# Altium schematic sheet IRIS-FE-01-B-LEDs.SchDoc
size A
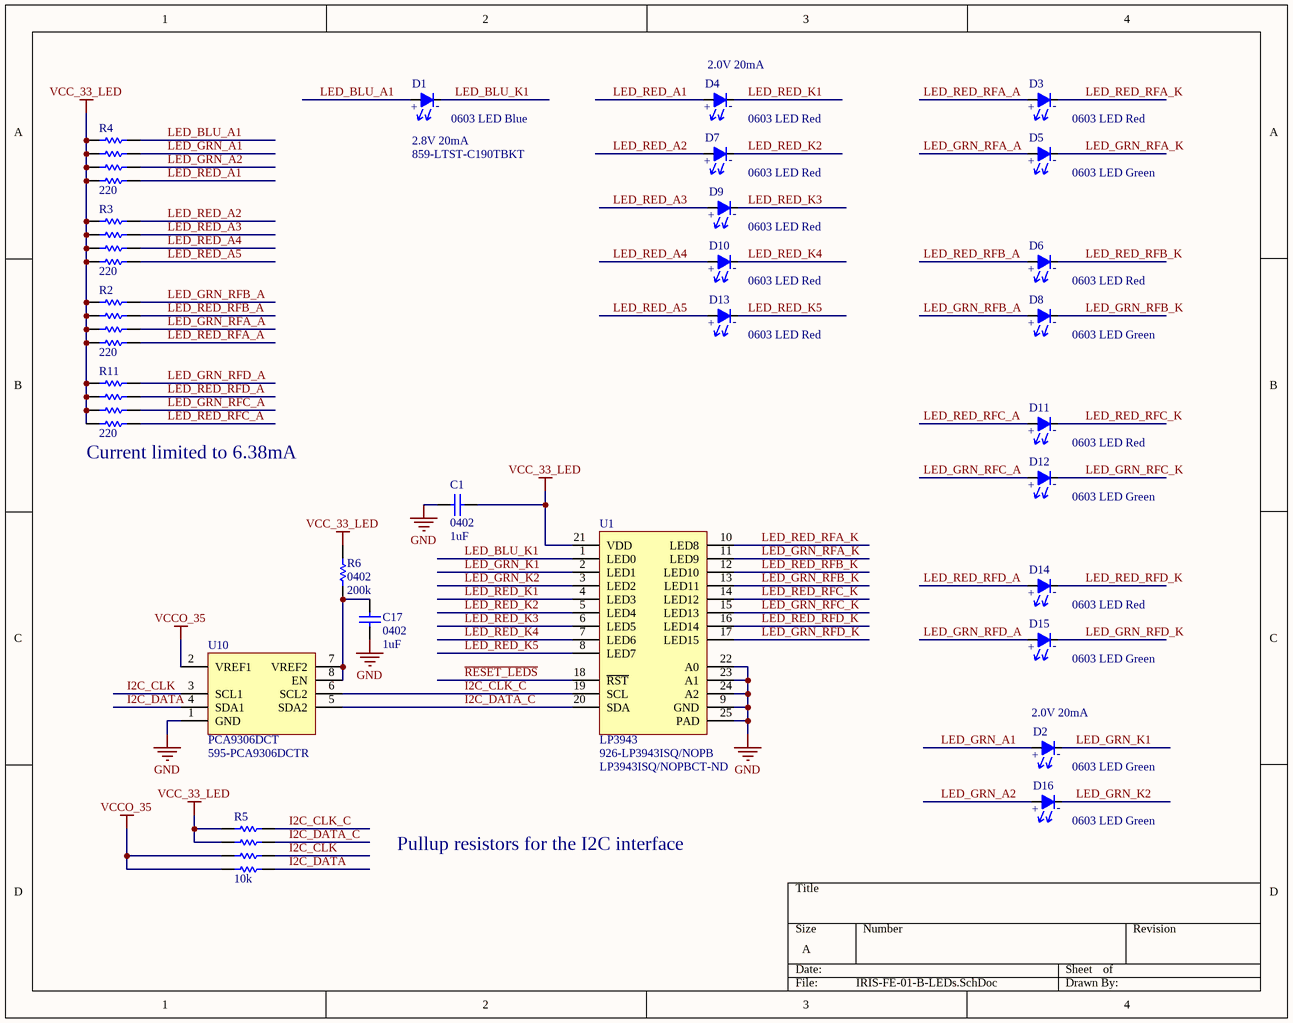
[diagram p0: IRIS-FE-01-B-LEDs.SchDoc]

## Parts
C1  0402  value 1uF  [0402_SMT_CAP]
C17  0402  value 1uF  [0402_SMT_CAP]
D1  0603 LED Blue  value 2.8V 20mA  Supplier Part Number 1: 859-LTST-C190TBKT  [0603_SMT_LED_Blue]
D2  0603 LED Green  value 2.0V 20mA  [0603_SMT_LED_Green]
D3  0603 LED Red  [0603_SMT_LED_Red]
D4  0603 LED Red  value 2.0V 20mA  [0603_SMT_LED_Red]
D5  0603 LED Green  [0603_SMT_LED_Green]
D6  0603 LED Red  [0603_SMT_LED_Red]
D7  0603 LED Red  [0603_SMT_LED_Red]
D8  0603 LED Green  [0603_SMT_LED_Green]
D9  0603 LED Red  [0603_SMT_LED_Red]
D10  0603 LED Red  [0603_SMT_LED_Red]
D11  0603 LED Red  [0603_SMT_LED_Red]
D12  0603 LED Green  [0603_SMT_LED_Green]
D13  0603 LED Red  [0603_SMT_LED_Red]
D14  0603 LED Red  [0603_SMT_LED_Red]
D15  0603 LED Green  [0603_SMT_LED_Green]
D16  0603 LED Green  [0603_SMT_LED_Green]
R2  value 220  [EXB28V]  (hidden comment: 0402 Array)
R3  value 220  [EXB28V]  (hidden comment: 0402 Array)
R4  value 220  [EXB28V]  (hidden comment: 0402 Array)
R5  value 10k  [EXB28V]  (hidden comment: 0402 Array)
R6  0402  value 200k  [0402_SMT_RES]
R11  value 220  [EXB28V]  (hidden comment: 0402 Array)
U1  LP3943  Supplier Part Number 1: 926-LP3943ISQ/NOPB  Supplier Part Number 2: LP3943ISQ/NOPBCT-ND  [TI-QFN127P600-8N]
U10  PCA9306DCT  Supplier Part Number 1: 595-PCA9306DCTR  [TI-SOP127P600-8N]

## Nets
GND: C1.2 C17.1 U1.9(GND) U1.22(A0) U1.23(A1) U1.24(A2) U1.25(PAD) U10.1(GND)
VCC_33_LED: C1.1 R2.1 R2.2 R2.3 R2.4 R3.1 R3.2 R3.3 R3.4 R4.1 R4.2 R4.3 R4.4 R5.5 R5.6 R6.2 R11.1 R11.2 R11.3 R11.4 U1.21(VDD)
VCCO_35: R5.7 R5.8 U10.2(VREF1)
~{RESET_LEDS}: U1.18(~{RST})
I2C_CLK: R5.2 U10.3(SCL1)
I2C_CLK_C: R5.4 U1.19(SCL) U10.6(SCL2)
I2C_DATA: R5.1 U10.4(SDA1)
I2C_DATA_C: R5.3 U1.20(SDA) U10.5(SDA2)
LED_BLU_A1: D1.1(P) R4.8
LED_BLU_K1: D1.2(N) U1.1(LED0)
LED_GRN_A1: D2.1(P) R4.7
LED_GRN_A2: D16.1(P) R4.6
LED_GRN_K1: D2.2(N) U1.2(LED1)
LED_GRN_K2: D16.2(N) U1.3(LED2)
LED_GRN_RFA_A: D5.1(P) R2.6
LED_GRN_RFA_K: D5.2(N) U1.11(LED9)
LED_GRN_RFB_A: D8.1(P) R2.8
LED_GRN_RFB_K: D8.2(N) U1.13(LED11)
LED_GRN_RFC_A: D12.1(P) R11.6
LED_GRN_RFC_K: D12.2(N) U1.15(LED13)
LED_GRN_RFD_A: D15.1(P) R11.8
LED_GRN_RFD_K: D15.2(N) U1.17(LED15)
LED_RED_A1: D4.1(P) R4.5
LED_RED_A2: D7.1(P) R3.8
LED_RED_A3: D9.1(P) R3.7
LED_RED_A4: D10.1(P) R3.6
LED_RED_A5: D13.1(P) R3.5
LED_RED_K1: D4.2(N) U1.4(LED3)
LED_RED_K2: D7.2(N) U1.5(LED4)
LED_RED_K3: D9.2(N) U1.6(LED5)
LED_RED_K4: D10.2(N) U1.7(LED6)
LED_RED_K5: D13.2(N) U1.8(LED7)
LED_RED_RFA_A: D3.1(P) R2.5
LED_RED_RFA_K: D3.2(N) U1.10(LED8)
LED_RED_RFB_A: D6.1(P) R2.7
LED_RED_RFB_K: D6.2(N) U1.12(LED10)
LED_RED_RFC_A: D11.1(P) R11.5
LED_RED_RFC_K: D11.2(N) U1.14(LED12)
LED_RED_RFD_A: D14.1(P) R11.7
LED_RED_RFD_K: D14.2(N) U1.16(LED14)
NetC17_2: C17.2 R6.1 U10.7(VREF2) U10.8(EN)

## Notes on the sheet
- (near R11) Current limited to 6.38mA
- Pullup resistors for the I2C interface
- (in symbol LED_0603_BLUE) +; -
- (in symbol LED_0603_GREEN) +; -
- (in symbol LED_0603_RED) +; -

## Library data of the parts
C1 C17 = Cap_0402: 0402 SMT Capacitor; Supplier 1: Mouser; Supplier Part Number 1: 81-GRM155R61E105KA2D
D1 = LED_0603_BLUE: 0603 LED with Polar Markings; Supplier 1: Mouser
D2 = LED_0603_GREEN: 0603 LED with Polar Markings; Supplier 1: Mouser; Supplier Part Number 1: 859-LTST-C191KGKT
D3 D6 D7 D9-D11 D13 D14 = LED_0603_RED: 0603 LED with Polar Markings; Value: 2.0V 20mA; Supplier 1: Mouser; Supplier Part Number 1: 859-LTST-C191KRKT
D4 = LED_0603_RED: 0603 LED with Polar Markings; Supplier 1: Mouser; Supplier Part Number 1: 859-LTST-C191KRKT
D5 D8 D12 D15 D16 = LED_0603_GREEN: 0603 LED with Polar Markings; Value: 2.0V 20mA; Supplier 1: Mouser; Supplier Part Number 1: 859-LTST-C191KGKT
R2-R5 R11 = Res_0402_4xArray: 0402 SMT Resistor Array; Supplier 1: Mouser
  R2-R4 R11: Supplier Part Number 1: 667-EXB-28V221JX
  R5: Supplier Part Number 1: 667-EXB-28V103JX; Supplier 2: Digi-Key; Supplier Part Number 2: Y7103CT-ND
R6 = Res_0402: 0402 SMT Resistor; Supplier 1: Mouser; Supplier Part Number 1: 667-ERJ-2RKF2003X
U1 = LP3943: TI 16-LED Fun Light Driver with I2C; Supplier 1: Mouser; Supplier 2: Digi-Key
U10 = PCA9306DCT: TI I2C Bidirectional Voltage Translator; Supplier 1: Mouser